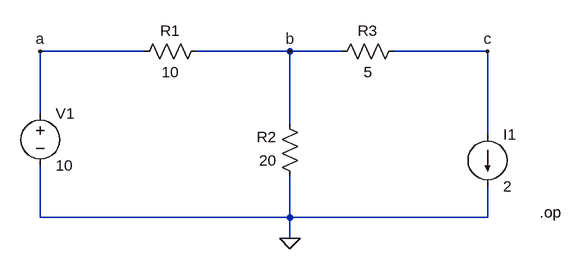
[diagram p0: schematic Lab05Circuit01.asc]
Lab05Circuit01.asc, the LTspice schematic file:
Version 4
SHEET 1 888 680
WIRE 240 48 80 48
WIRE 464 48 320 48
WIRE 544 48 464 48
WIRE 768 48 624 48
WIRE 80 144 80 48
WIRE 464 160 464 48
WIRE 768 176 768 48
WIRE 80 304 80 224
WIRE 464 304 464 240
WIRE 464 304 80 304
WIRE 768 304 768 256
WIRE 768 304 464 304
WIRE 464 336 464 304
FLAG 464 336 0
FLAG 80 48 a
FLAG 464 48 b
FLAG 768 48 c
SYMBOL voltage 80 128 R0
WINDOW 123 0 0 Left 0
WINDOW 39 0 0 Left 0
SYMATTR InstName V1
SYMATTR Value 10
SYMBOL res 336 32 R90
WINDOW 0 0 56 VBottom 2
WINDOW 3 32 56 VTop 2
SYMATTR InstName R1
SYMATTR Value 10
SYMBOL res 480 256 R180
WINDOW 0 36 76 Left 2
WINDOW 3 36 40 Left 2
SYMATTR InstName R2
SYMATTR Value 20
SYMBOL current 768 176 R0
WINDOW 123 0 0 Left 0
WINDOW 39 0 0 Left 0
SYMATTR InstName I1
SYMATTR Value 2
SYMBOL res 640 32 R90
WINDOW 0 0 56 VBottom 2
WINDOW 3 32 56 VTop 2
SYMATTR InstName R3
SYMATTR Value 5
TEXT 848 296 Left 2 !.op

The netlist it stands for:
* Lab05Circuit01.asc
V1 a 0 10
R1 b a 10
R2 0 b 20
I1 c 0 2
R3 c b 5
.op
.backanno
.end